# Altium schematic sheet obc-v2_CM4-POWER.SchDoc
size 420 x 297 mm; SheetNumber: 21; SheetTotal: 23
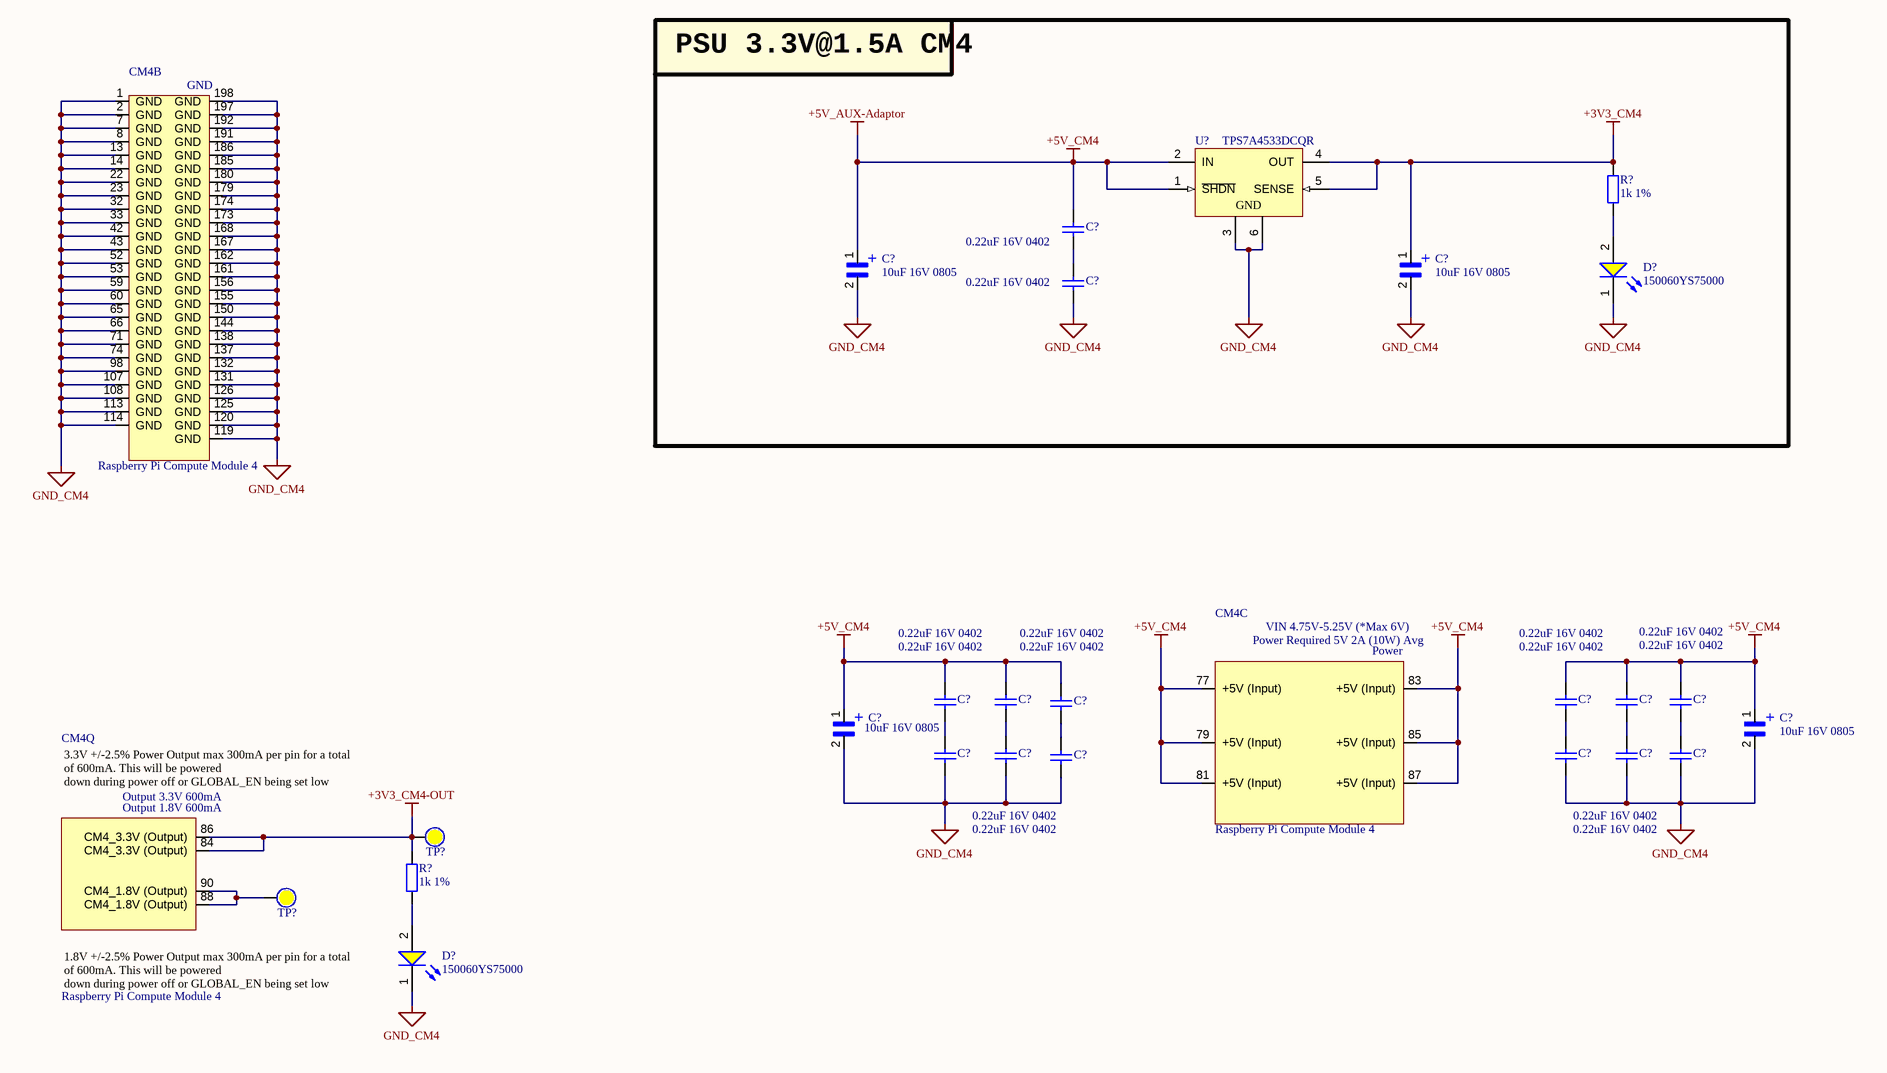
[diagram p0: obc-v2_CM4-POWER.SchDoc]

## Parts
(Parts that share a designator on the sheet are numbered #1, #2 ... from top to bottom, then left to right.)
C?#1  0.22uF 16V 0402  [tu 0402]
C?#2  10uF 16V 0805  [CAPC2012X140N]
C?#3  10uF 16V 0805  [CAPC2012X140N]
C?#4  0.22uF 16V 0402  [tu 0402]
C?#5  0.22uF 16V 0402  [tu 0402]
C?#6  0.22uF 16V 0402  [tu 0402]
C?#7  0.22uF 16V 0402  [tu 0402]
C?#8  0.22uF 16V 0402  [tu 0402]
C?#9  0.22uF 16V 0402  [tu 0402]
C?#10  0.22uF 16V 0402  [tu 0402]
C?#11  10uF 16V 0805  [CAPC2012X140N]
C?#12  10uF 16V 0805  [CAPC2012X140N]
C?#13  0.22uF 16V 0402  [tu 0402]
C?#14  0.22uF 16V 0402  [tu 0402]
C?#15  0.22uF 16V 0402  [tu 0402]
C?#16  0.22uF 16V 0402  [tu 0402]
C?#17  0.22uF 16V 0402  [tu 0402]
C?#18  0.22uF 16V 0402  [tu 0402]
CM4  Raspberry Pi Compute Module 4  [CM4-DF40HC(3.0)-100DS-0.4v_3mm_1.5mm]  (parts B,C,Q of 21)  (no BOM)
D?#1  150060YS75000  [WL-SMCW_0603_150060xx75000]
D?#2  150060YS75000  [WL-SMCW_0603_150060xx75000]
R?#1  1k 1%  [tro smd 0603]
R?#2  1k 1%  [tro smd 0603]
TP?#1  (no value)  [Test Point 1 Side]  (no BOM)
TP?#2  (no value)  [Test Point 1 Side]  (no BOM)
U?  TPS7A4533DCQR  [DCQ0006A_M]

## Blocks framed on the sheet
PSU 3.3V@1.5A CM4: C?#1-C?#4 D?#1 R?#1 U?

## Nets
+3V3_CM4: C?#3.1 R?#1.2 U?.4(OUT) U?.5(SENSE)
+3V3_CM4-OUT: CM4.84(CM4_3.3V_(Output)) CM4.86(CM4_3.3V_(Output)) R?#2.2 TP?#1.0
+5V_AUX-Adaptor: C?#1.1 C?#2.1 C?#5.1 C?#6.1 C?#7.1 C?#8.1 C?#9.1 C?#10.1 C?#11.1 C?#12.1 CM4.77(+5V_(Input)) CM4.79(+5V_(Input)) CM4.81(+5V_(Input)) CM4.83(+5V_(Input)) CM4.85(+5V_(Input)) CM4.87(+5V_(Input)) U?.1(~{SHDN}) U?.2(IN)  [also labelled +5V_CM4]
GND_CM4: C?#2.2 C?#3.2 C?#4.2 C?#11.2 C?#12.2 C?#13.2 C?#14.2 C?#15.2 C?#16.2 C?#17.2 C?#18.2 CM4.1(GND) CM4.2(GND) CM4.7(GND) CM4.8(GND) CM4.13(GND) CM4.14(GND) CM4.22(GND) CM4.23(GND) CM4.32(GND) CM4.33(GND) CM4.42(GND) CM4.43(GND) CM4.52(GND) CM4.53(GND) CM4.59(GND) CM4.60(GND) CM4.65(GND) CM4.66(GND) CM4.71(GND) CM4.74(GND) CM4.98(GND) CM4.107(GND) CM4.108(GND) CM4.113(GND) CM4.114(GND) CM4.119(GND) CM4.120(GND) CM4.125(GND) CM4.126(GND) CM4.131(GND) CM4.132(GND) CM4.137(GND) CM4.138(GND) CM4.144(GND) CM4.150(GND) CM4.155(GND) CM4.156(GND) CM4.161(GND) CM4.162(GND) CM4.167(GND) CM4.168(GND) CM4.173(GND) CM4.174(GND) CM4.179(GND) CM4.180(GND) CM4.185(GND) CM4.186(GND) CM4.191(GND) CM4.192(GND) CM4.197(GND) CM4.198(GND) D?#1.1(K) D?#2.1(K) U?.3(GND) U?.6(GND)
NetC?#1_2: C?#1.2 C?#4.1
NetC?#5_2: C?#5.2 C?#13.1
NetC?#6_2: C?#6.2 C?#14.1
NetC?#7_2: C?#7.2 C?#15.1
NetC?#8_2: C?#8.2 C?#16.1
NetC?#9_2: C?#9.2 C?#17.1
NetC?#10_2: C?#10.2 C?#18.1
NetCM4_88: CM4.88(CM4_1.8V_(Output)) CM4.90(CM4_1.8V_(Output)) TP?#2.0
NetD?#1_2: D?#1.2(A) R?#1.1
NetD?#2_2: D?#2.2(A) R?#2.1

## Notes on the sheet
- Project:
- Sub-system:
- Design by:
- Sheet title:
- Sheet
- A3
- of
- Checked by:
- Approved by:
- Revision:
- Document No:
- Size:
- Date:
- (in symbol CM4, part C) VIN 4.75V-5.25V (*Max 6V); Power Required 5V 2A (10W) Avg; Power; by Amornthep Phunsin
- (in symbol CM4, part Q) 3.3V +/-2.5% Power Output max 300mA per pin for a total of 600mA. This will be powered / down during power off or GLOBAL_EN being set low; Output 3.3V 600mA; Output 1.8V 600mA; 1.8V +/-2.5% Power Output max 300mA per pin for a total of 600mA. This will be powered / down during power off or GLOBAL_EN being set low
- (in symbol TACR686M003RTA) +

## Library data of the parts
C?#1 C?#4-C?#10 C?#13-C?#18 = Tu 0402 33nF 10V: 0.22 µF ±10% 16V Ceramic Capacitor X7R 0402 (1005 Metric): GCM155R71C224KE02D; Chung_Loai: Dán; Don_Vi: Con; So_Chan: 2; Ten_Linh_Kien: Tụ 0402 33nF X7R 10V GRM155R71A333KA01D; Ma_Hang: MH007853; Kieu_Chan: *
C?#2 C?#3 C?#11 C?#12 = TACR686M003RTA: 10 µF Molded Tantalum Capacitors 16 V 0805 (2012 Metric) 8Ohm @ 100kHz: TP8R106M016C; MF: AVX; Availability: Unavailable; SnapEDA_Link: https://www.snapeda.com/parts/TACR686M003RTA/AVX/view-part/1745975/?ref=snap; MP: TACR686M003RTA; Value: *; Price: None; Package: 0805 AVX
CM4 = CM4: Raspberry Pi Compute Module 4 by Amornthep Phunsin
D?#1 D?#2 = CMP-1426-00005-2: LED YELLOW CLEAR 0603 SMD; NexarPartId: 29687085; Wavelength: 590nm; Luminous Intensity: 120mcd; Peak Wavelength: 595nm; Forward Current: 100mA; Power Dissipation: 72mW; Forward Voltage: 2V; Test Current: 20mA; Reverse Voltage: 5V; Lens Style: Clear, Rectangular; Max Junction Temperature (Tj): 95°C; Viewing Angle: 140°; Case Code (Imperial): 0603; Height: 700µm; REACH SVHC: Unknown; Dominant Wavelength: 590nm; Min Operating Temperature: -40°C; Color: Yellow; Width: 800µm; Mount: Surface Mount; Packaging: Tape and Reel; Max Operating Temperature: 85°C; RoHS: Compliant; Max Reverse Voltage (DC): 5V; Case Code (Metric): 1608; Length: 1.6mm; Case/Package: 0603
R?#1 R?#2 = Tro 0603 1% 10k: RES SMD 2.2K OHM 1% 1/10W 0603, P/N: ERJ-3EKF2201V; Chung_Loai: Dán; Don_Vi: Con; So_Chan: 2; Ten_Linh_Kien: Trở 0603 1% 10k; Ma_Hang: MH006333; Kieu_Chan: *
TP?#1 TP?#2 = Test Point: Solder: NF
U? = CMP-0395-00360-2: Single Output Fast Transient Response LDO, 1.5 A, Fixed 3.3 V Output, 2.1 to 20 V Input, 6-pin SOT-223 (DCQ), -40 to 125 degC, Green (RoHS & no Sb/Br); Manufacturer: Texas Instruments; Vout Adj(Max)(V): 3.3; Vin(Max)(V): 20; Accuracy(%): 1; SubFamily: Single Channel LDO; Vin(Min)(V): 2.1; Iout(Max)(A): 1.5; Vdo(Typ)(mV): 300; Eco-Plan: Green (RoHS & no Sb/Br); Mounting Technology: Surface Mount; PackageDescription: 6-Pin Plastic Small Outline, Body 3.5 x 6.5 mm, Pitch 1.27 mm; ComponentLink2URL: http://www.ti.com/general/docs/lit/getliterature.tsp?genericPartNumber=TPS7A4533&fileType=pdf; PackageReference: DCQ0006A; ComponentLink3Description: Package Specification; ComponentLink2Description: Datasheet; Fixed Output Options(V): 3.3; Iq(Typ)(mA): 1; ComponentLink1URL: http://www.ti.com/; PartNumber: TPS7A4533DCQR; ComponentLink1Description: Manufacturer URL; PackageVersion: 4202109/D; Vout Adj(Min)(V): 3.3; DatasheetVersion: SLVS720D; ComponentLink3URL: http://www.ti.com/litv/pdf/mpds098c